# Altium schematic sheet TELM0002ADC_BCR.SchDoc: MAX127 Telemetry Circuit
size A3; Engineer: A. SHAW; Organization: BLUEsat Project; Address1: Room 419; Address2: School of EE&T; Address3: UNSW, NSW 2052; Address4: Australia; DocumentNumber: TELM0002; SheetNumber: 1; SheetTotal: 1; Description: Telemetry ADC Circuit; Version: 1.0
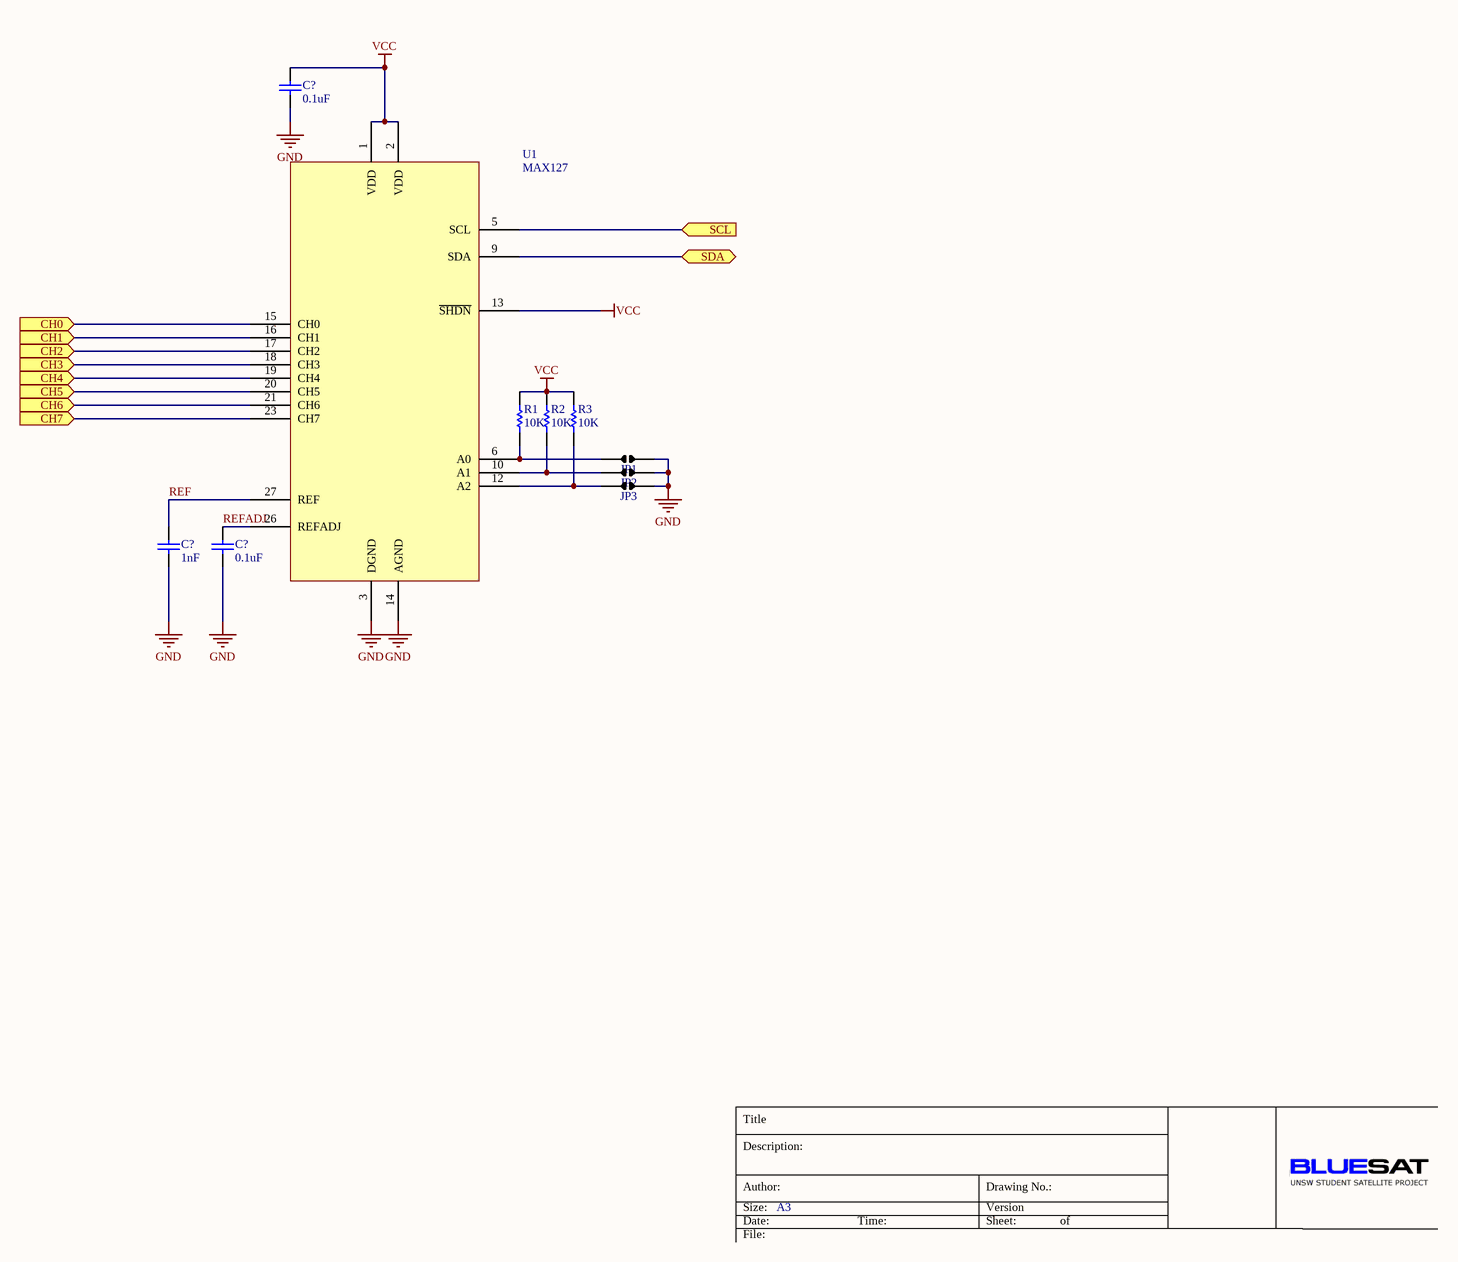
[diagram p0: TELM0002ADC_BCR.SchDoc]

## Parts
(Parts that share a designator on the sheet are numbered #1, #2 ... from top to bottom, then left to right.)
C?#1  value 0.1uF  [CAPC2012M]  (hidden comment: Cap)
C?#2  value 1nF  [CAPC2012M]  (hidden comment: Cap)
C?#3  value 0.1uF  [CAPC2012M]  (hidden comment: Cap)
JP1  Jumper  [Solder Jumper C]  (value not drawn)
JP2  Jumper  [Solder Jumper C]  (value not drawn)
JP3  Jumper  [Solder Jumper C]  (value not drawn)
R1  value 10K  [RESC2012M]  (hidden comment: 0805 Resistor)
R2  value 10K  [RESC2012M]  (hidden comment: 0805 Resistor)
R3  value 10K  [RESC2012M]  (hidden comment: 0805 Resistor)
U1  MAX127  [SSOP28 - MAX127]

## Ports
CH0 (in), CH1 (in), CH2 (in), CH3 (in), CH4 (in), CH5 (in), CH6 (in), CH7 (in), SCL (in), SDA (bidir)

## Nets
GND: C?#1.2 C?#2.2 C?#3.2 JP1.2 JP2.2 JP3.2 U1.3(DGND) U1.14(AGND)
VCC: C?#1.1 R1.1 R2.1 R3.1 U1.1(VDD) U1.2(VDD) U1.13(~{SHDN})
CH0: U1.15(CH0) ; port CH0
CH1: U1.16(CH1) ; port CH1
CH2: U1.17(CH2) ; port CH2
CH3: U1.18(CH3) ; port CH3
CH4: U1.19(CH4) ; port CH4
CH5: U1.20(CH5) ; port CH5
CH6: U1.21(CH6) ; port CH6
CH7: U1.23(CH7) ; port CH7
REF: C?#2.1 U1.27(REF)
REFADJ: C?#3.1 U1.26(REFADJ)
SCL: U1.5(SCL) ; port SCL
SDA: U1.9(SDA) ; port SDA
NetJP1_1: JP1.1 R1.2 U1.6(A0)
NetJP2_1: JP2.1 R2.2 U1.10(A1)
NetJP3_1: JP3.1 R3.2 U1.12(A2)

## Notes on the sheet
- Title
- Description:
- Size:
- Author:
- Date:
- A3
- Time:
- Version
- Sheet:
- Drawing No.:
- of
- File:

## Library data of the parts
C?#1-C?#3 = Cap: Capacitor; Published: 8-Jun-2000; LatestRevisionDate: 17-Jul-2002; LatestRevisionNote: Re-released for DXP Platform.; PackageReference: RAD-0.3; Publisher: Altium Limited; PackageDescription: Radial Cap, Thru-Hole; 2 Leads; 0.3 in Pin Spacing; Supplier 1: Farnell; Supplier 2: Farnell; Supplier Part Number 2: 1759265
JP1-JP3 = Solder Bridge
R1-R3 = Res1: Resistor; Published: 8-Jun-2000; LatestRevisionDate: 17-Jul-2002; LatestRevisionNote: Re-released for DXP Platform.; PackageReference: AXIAL-0.3; Publisher: Altium Limited; PackageDescription: Axial Device, Thru-Hole; 2 Leads; 0.3 in Pin Spacing; Supplier 1: Farnell
U1 = MAX127: 8 Channel, 12 bit, I2C DAS